# Altium schematic sheet Main.SchDoc
size A4
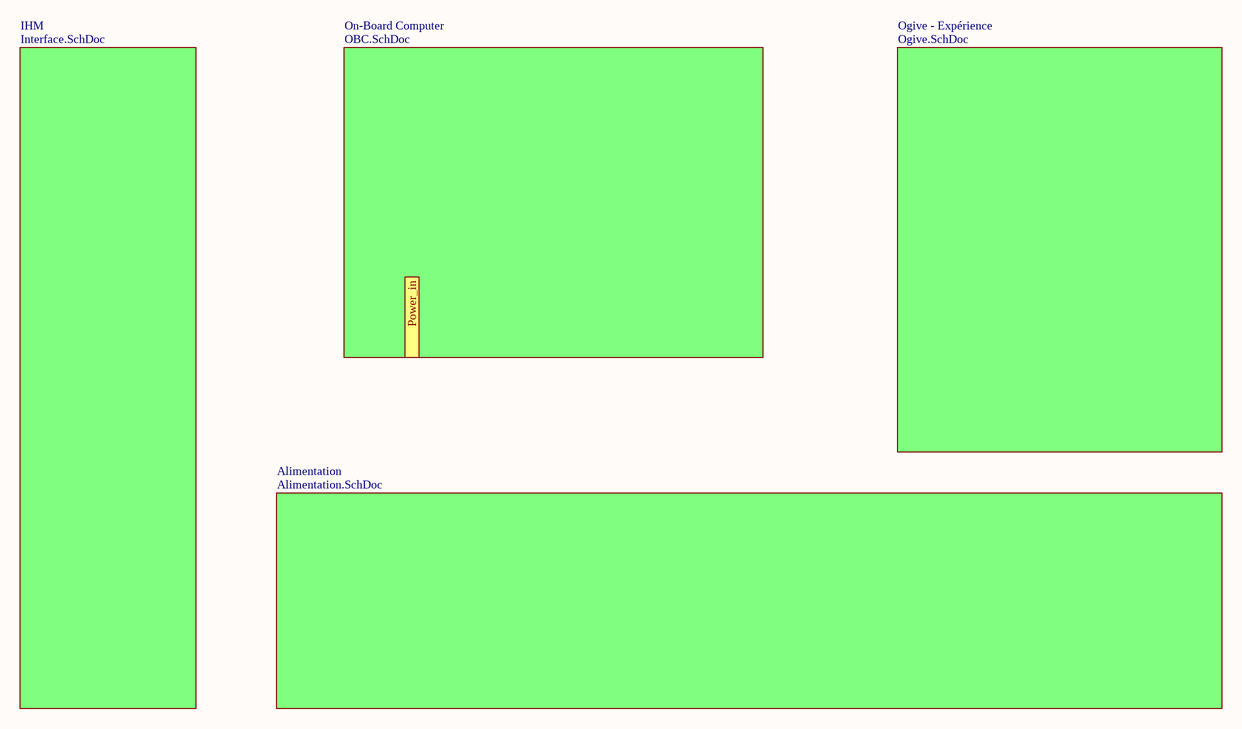
[diagram p0: Main.SchDoc]

## Sub-sheets
Alimentation = Alimentation.SchDoc: no entries
IHM = Interface.SchDoc: no entries
Ogive - Expérience = Ogive.SchDoc: no entries
On-Board Computer = OBC.SchDoc: no entries

## Ports
Power_in (in)